# Altium schematic sheet FPGA SDRAM bank.SchDoc: SVPXFMC Carrier 3U
size 420 x 297 mm; CheckedBy: \; Author: G.Kasprowicz; CompanyName: ISE; DrawnBy: T.Przywozki; Organization: WUT ISE; Address1: Warsaw University of Technology; Address2: Nowowiejska 15/19 00-665 Warsaw; Revision: 1.0.; SheetNumber: 5; SheetTotal: 20; Projet: SVPXFMC Carrier 3U; ModifiedBy: -; CheckedDate: -; Title2: FPGA SDRAM BANK; DivGrp: ISE; Designer: G.Kasprowicz; Project: SVPXFMC Carrier 3U
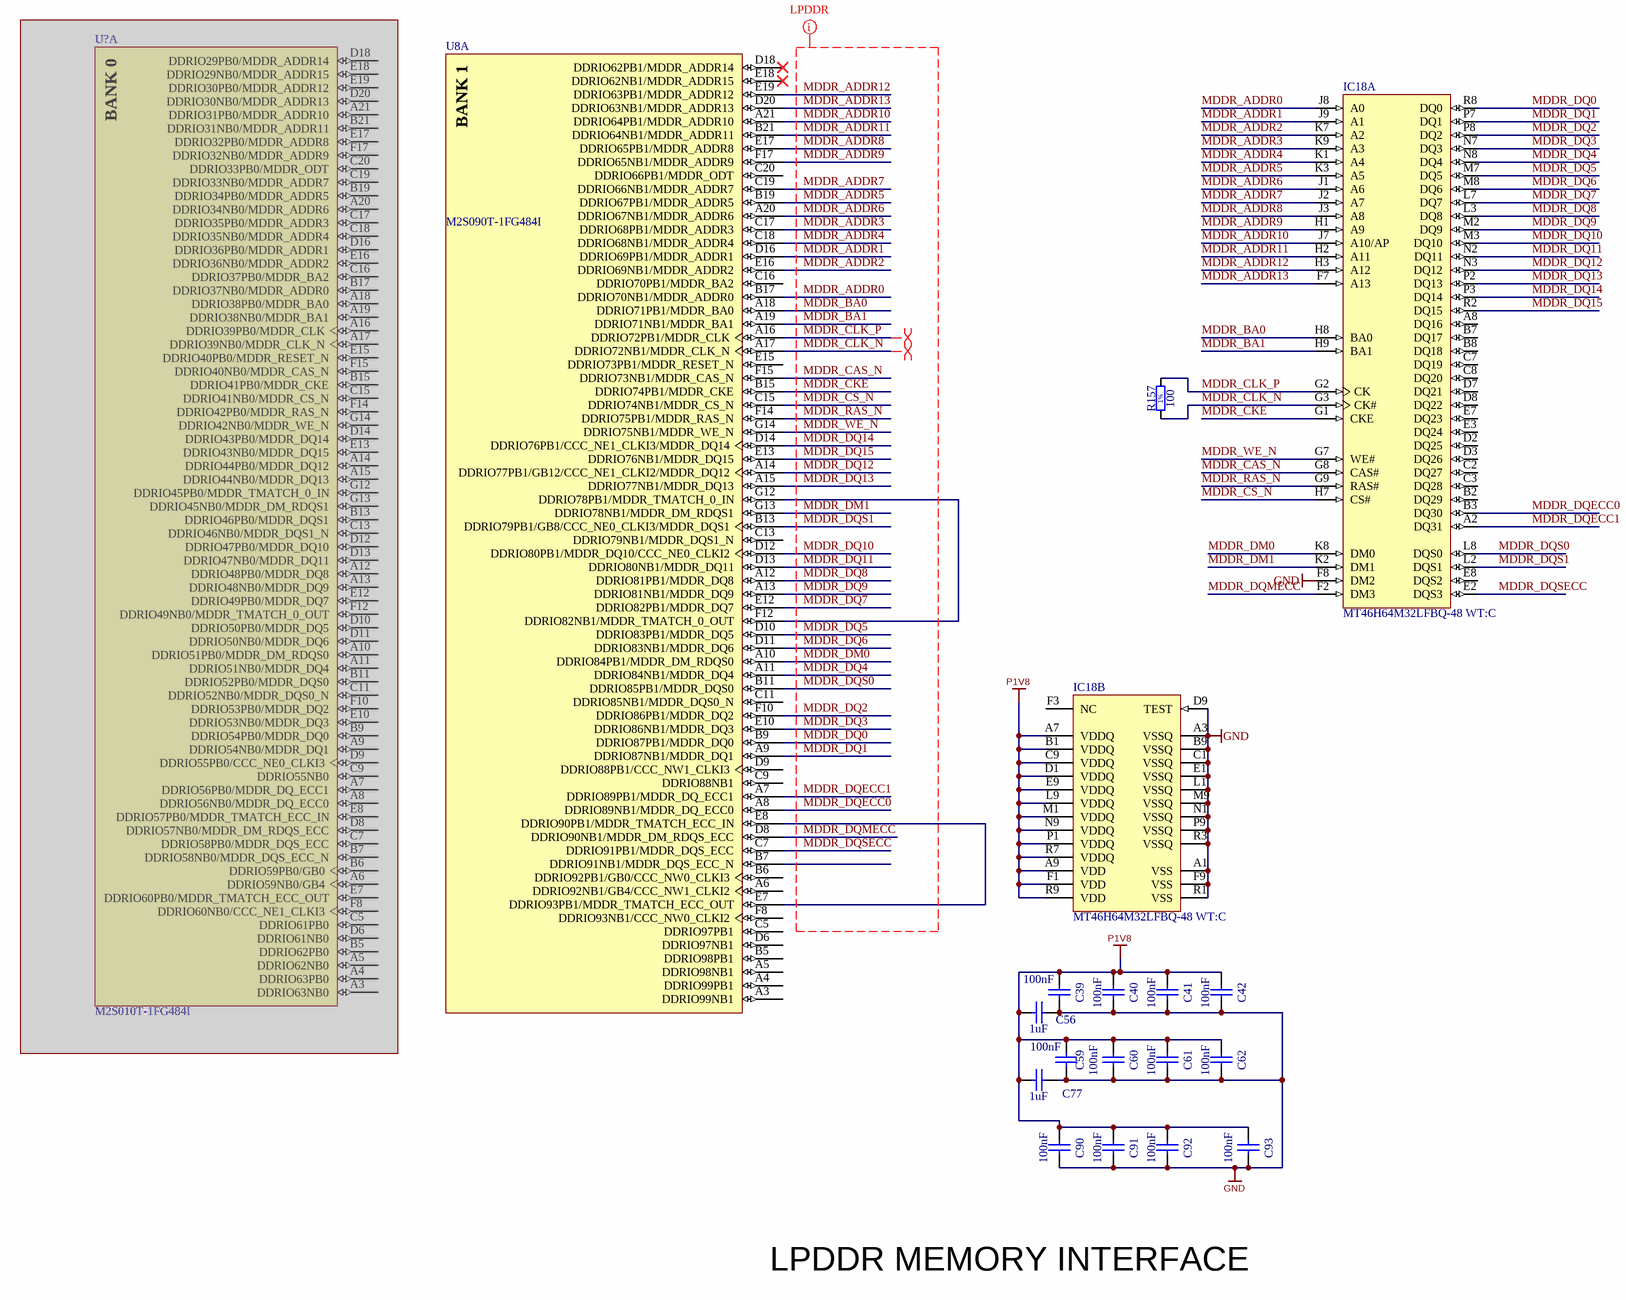
[diagram p0: FPGA SDRAM bank.SchDoc]

## Parts
C39  100nF  [CAPC0603X33N]
C40  100nF  [CAPC0603X33N]
C41  100nF  [CAPC0603X33N]
C42  100nF  [CAPC0603X33N]
C56  1uF  [CAPC1005X55N]
C59  100nF  [CAPC0603X33N]
C60  100nF  [CAPC0603X33N]
C61  100nF  [CAPC0603X33N]
C62  100nF  [CAPC0603X33N]
C77  1uF  [CAPC1005X55N]
C90  100nF  [CAPC0603X33N]
C91  100nF  [CAPC0603X33N]
C92  100nF  [CAPC0603X33N]
C93  100nF  [CAPC0603X33N]
IC18  MT46H64M32LFBQ-48 WT:C  [VFBGA90]  (parts A,B of 2)
R157  100  [RESC0603X28N]
U8  M2S090T-1FG484I  [MCSM-FG-484_V]  (part A of 15)
U?  M2S010T-1FG484I  [MCSM-FG-484_V]  (part A of 16)  (masked out: inside a compile mask, not in the netlist)

## Nets
GND: C39.2 C40.2 C41.2 C42.2 C56.2 C59.2 C60.2 C61.2 C62.2 C77.2 C90.2 C91.2 C92.2 C93.1 IC18.A1(VSS) IC18.A3(VSSQ) IC18.B9(VSSQ) IC18.C1(VSSQ) IC18.D9(TEST) IC18.E1(VSSQ) IC18.F8(DM2) IC18.F9(VSS) IC18.L1(VSSQ) IC18.M9(VSSQ) IC18.N1(VSSQ) IC18.P9(VSSQ) IC18.R1(VSS) IC18.R3(VSSQ)
P1V8: C39.1 C40.1 C41.1 C42.1 C56.1 C59.1 C60.1 C61.1 C62.1 C77.1 C90.1 C91.1 C92.1 C93.2 IC18.A7(VDDQ) IC18.A9(VDD) IC18.B1(VDDQ) IC18.C9(VDDQ) IC18.D1(VDDQ) IC18.E9(VDDQ) IC18.F1(VDD) IC18.L9(VDDQ) IC18.M1(VDDQ) IC18.N9(VDDQ) IC18.P1(VDDQ) IC18.R7(VDDQ) IC18.R9(VDD)
MDDR_ADDR0: IC18.J8(A0) U8.B17(DDRIO70NB1/MDDR_ADDR0)
MDDR_ADDR1: IC18.J9(A1) U8.D16(DDRIO69PB1/MDDR_ADDR1)
MDDR_ADDR2: IC18.K7(A2) U8.E16(DDRIO69NB1/MDDR_ADDR2)
MDDR_ADDR3: IC18.K9(A3) U8.C17(DDRIO68PB1/MDDR_ADDR3)
MDDR_ADDR4: IC18.K1(A4) U8.C18(DDRIO68NB1/MDDR_ADDR4)
MDDR_ADDR5: IC18.K3(A5) U8.B19(DDRIO67PB1/MDDR_ADDR5)
MDDR_ADDR6: IC18.J1(A6) U8.A20(DDRIO67NB1/MDDR_ADDR6)
MDDR_ADDR7: IC18.J2(A7) U8.C19(DDRIO66NB1/MDDR_ADDR7)
MDDR_ADDR8: IC18.J3(A8) U8.E17(DDRIO65PB1/MDDR_ADDR8)
MDDR_ADDR9: IC18.H1(A9) U8.F17(DDRIO65NB1/MDDR_ADDR9)
MDDR_ADDR10: IC18.J7(A10/AP) U8.A21(DDRIO64PB1/MDDR_ADDR10)
MDDR_ADDR11: IC18.H2(A11) U8.B21(DDRIO64NB1/MDDR_ADDR11)
MDDR_ADDR12: IC18.H3(A12) U8.E19(DDRIO63PB1/MDDR_ADDR12)
MDDR_ADDR13: IC18.F7(A13) U8.D20(DDRIO63NB1/MDDR_ADDR13)
MDDR_BA0: IC18.H8(BA0) U8.A18(DDRIO71PB1/MDDR_BA0)
MDDR_BA1: IC18.H9(BA1) U8.A19(DDRIO71NB1/MDDR_BA1)
MDDR_CAS_N: IC18.G8(CAS#) U8.F15(DDRIO73NB1/MDDR_CAS_N)
MDDR_CKE: IC18.G1(CKE) U8.B15(DDRIO74PB1/MDDR_CKE)
MDDR_CLK_N: IC18.G3(CK#) R157.1 U8.A17(DDRIO72NB1/MDDR_CLK_N)
MDDR_CLK_P: IC18.G2(CK) R157.2 U8.A16(DDRIO72PB1/MDDR_CLK)
MDDR_CS_N: IC18.H7(CS#) U8.C15(DDRIO74NB1/MDDR_CS_N)
MDDR_DM0: IC18.K8(DM0) U8.A10(DDRIO84PB1/MDDR_DM_RDQS0)
MDDR_DM1: IC18.K2(DM1) U8.G13(DDRIO78NB1/MDDR_DM_RDQS1)
MDDR_DQ0: IC18.R8(DQ0) U8.B9(DDRIO87PB1/MDDR_DQ0)
MDDR_DQ1: IC18.P7(DQ1) U8.A9(DDRIO87NB1/MDDR_DQ1)
MDDR_DQ2: IC18.P8(DQ2) U8.F10(DDRIO86PB1/MDDR_DQ2)
MDDR_DQ3: IC18.N7(DQ3) U8.E10(DDRIO86NB1/MDDR_DQ3)
MDDR_DQ4: IC18.N8(DQ4) U8.A11(DDRIO84NB1/MDDR_DQ4)
MDDR_DQ5: IC18.M7(DQ5) U8.D10(DDRIO83PB1/MDDR_DQ5)
MDDR_DQ6: IC18.M8(DQ6) U8.D11(DDRIO83NB1/MDDR_DQ6)
MDDR_DQ7: IC18.L7(DQ7) U8.E12(DDRIO82PB1/MDDR_DQ7)
MDDR_DQ8: IC18.L3(DQ8) U8.A12(DDRIO81PB1/MDDR_DQ8)
MDDR_DQ9: IC18.M2(DQ9) U8.A13(DDRIO81NB1/MDDR_DQ9)
MDDR_DQ10: IC18.M3(DQ10) U8.D12(DDRIO80PB1/MDDR_DQ10/CCC_NE0_CLKI2)
MDDR_DQ11: IC18.N2(DQ11) U8.D13(DDRIO80NB1/MDDR_DQ11)
MDDR_DQ12: IC18.N3(DQ12) U8.A14(DDRIO77PB1/GB12/CCC_NE1_CLKI2/MDDR_DQ12)
MDDR_DQ13: IC18.P2(DQ13) U8.A15(DDRIO77NB1/MDDR_DQ13)
MDDR_DQ14: IC18.P3(DQ14) U8.D14(DDRIO76PB1/CCC_NE1_CLKI3/MDDR_DQ14)
MDDR_DQ15: IC18.R2(DQ15) U8.E13(DDRIO76NB1/MDDR_DQ15)
MDDR_DQECC0: IC18.B3(DQ30) U8.A8(DDRIO89NB1/MDDR_DQ_ECC0)
MDDR_DQECC1: IC18.A2(DQ31) U8.A7(DDRIO89PB1/MDDR_DQ_ECC1)
MDDR_DQMECC: IC18.F2(DM3) U8.D8(DDRIO90NB1/MDDR_DM_RDQS_ECC)
MDDR_DQS0: IC18.L8(DQS0) U8.B11(DDRIO85PB1/MDDR_DQS0)
MDDR_DQS1: IC18.L2(DQS1) U8.B13(DDRIO79PB1/GB8/CCC_NE0_CLKI3/MDDR_DQS1)
MDDR_DQSECC: IC18.E2(DQS3) U8.C7(DDRIO91PB1/MDDR_DQS_ECC)
MDDR_RAS_N: IC18.G9(RAS#) U8.F14(DDRIO75PB1/MDDR_RAS_N)
MDDR_WE_N: IC18.G7(WE#) U8.G14(DDRIO75NB1/MDDR_WE_N)
NetU8_E7: U8.E7(DDRIO93PB1/MDDR_TMATCH_ECC_OUT) U8.E8(DDRIO90PB1/MDDR_TMATCH_ECC_IN)
NetU8_F12: U8.F12(DDRIO82NB1/MDDR_TMATCH_0_OUT) U8.G12(DDRIO78PB1/MDDR_TMATCH_0_IN)

Not connected (* = marked no-connect by the designer): IC18 A8(DQ16) B2(DQ29) B7(DQ17) B8(DQ18) C2(DQ27) C3(DQ28) C7(DQ19) C8(DQ20) D2(DQ25) D3(DQ26) D7(DQ21) D8(DQ22) E3(DQ24) E7(DQ23) E8(DQS2) F3(NC); U8 A3(DDRIO99NB1) A4(DDRIO99PB1) A5(DDRIO98NB1) A6(DDRIO92NB1/GB4/CCC_NW1_CLKI2) B5(DDRIO98PB1) B6(DDRIO92PB1/GB0/CCC_NW0_CLKI3) B7(DDRIO91NB1/MDDR_DQS_ECC_N) C5(DDRIO97PB1) C9(DDRIO88NB1) C11(DDRIO85NB1/MDDR_DQS0_N) C13(DDRIO79NB1/MDDR_DQS1_N) C16(DDRIO70PB1/MDDR_BA2) C20(DDRIO66PB1/MDDR_ODT) D6(DDRIO97NB1) D9(DDRIO88PB1/CCC_NW1_CLKI3) D18(DDRIO62PB1/MDDR_ADDR14)* E15(DDRIO73PB1/MDDR_RESET_N) E18(DDRIO62NB1/MDDR_ADDR15)* F8(DDRIO93NB1/CCC_NW0_CLKI2)

## Layout directives
net class LPDDR: MDDR_ADDR0, MDDR_ADDR1, MDDR_ADDR2, MDDR_ADDR3, MDDR_ADDR4, MDDR_ADDR5, MDDR_ADDR6, MDDR_ADDR7, MDDR_ADDR8, MDDR_ADDR9, MDDR_ADDR10, MDDR_ADDR11, MDDR_ADDR12, MDDR_ADDR13, MDDR_BA0, MDDR_BA1, MDDR_CAS_N, MDDR_CKE, MDDR_CLK_N, MDDR_CLK_P, MDDR_CS_N, MDDR_DM0, MDDR_DM1, MDDR_DQ0, MDDR_DQ1, MDDR_DQ2, MDDR_DQ3, MDDR_DQ4, MDDR_DQ5, MDDR_DQ6, MDDR_DQ7, MDDR_DQ8, MDDR_DQ9, MDDR_DQ10, MDDR_DQ11, MDDR_DQ12, MDDR_DQ13, MDDR_DQ14, MDDR_DQ15, MDDR_DQECC0, MDDR_DQECC1, MDDR_DQMECC, MDDR_DQS0, MDDR_DQS1, MDDR_DQSECC, MDDR_RAS_N, MDDR_WE_N
differential pair; differential pair class Diff_100: MDDR_CLK_N, MDDR_CLK_P

## Notes on the sheet
- LPDDR MEMORY INTERFACE
- Project/Equipment
- Document
- Designer
- Drawn by
- Check.by
- File
- Last Mod.
- Print Date
- Sheet
- Size
- A3
- of
- Rev
- Copyright WUT ISE 2019
  This documentation describes Open Hardware and is licensed under the CERN OHL v.1.1. You may redistribute and modify this documentation under the terms of the CERN OHL v1.1.
  (http://ohwr.org/CERNOHL). This documentation is dristributed WITHOUT ANY EXPRESS OR IMPLIED WARRANTY, INCLUDING OF MERCHANTABILITY, SATISFACTORY QUALITY AND FITNESS FOR A PARTICULAR PURPOSE. Please see the CERN OHL v.1.1 for applicable conditions
- (in symbol CMP-0959-00045-1, part A) BANK 1
- (in symbol CMP-0959-00069-1, part A) BANK 0
- (in symbol R0201_100R_1%_0.05W_200PPM) 1%

## Library data of the parts
C39-C42 C59-C62 C90-C93 = CC0201_100NF_6.3V_10%_X5R: Non-polarised capacitor; Manufacturer: GENERIC; Part Description: SMD Multilayer Chip Ceramic Capacitor; Manufacturer1 Part Number: 02016D104KAT2A; Tolerance: ±10%; Voltage: 6.3V; TC: X5R; Manufacturer Part Number: CC0201_100NF_6.3V_10%_X5R; Part Number: CC0201_100NF_6.3V_10%_X5R; Value: 100nF; Component Kind: Standard; Component Type: Standard; Pin Count: 2; Status: Not Recommended; Case: 0201; Mounted: Yes; Socket: No; SMD: Yes; Sense: No; Manufacturer1 Example: AVX; Manufacturer1 ComponentHeight: 0.33mm; HelpURL: \\cern.ch\dfs\Applications\Altium\Datasheets\CC0201_X5R_AVX.pdf; Author: CERN DEM JLC; CreateDate: 03/12/2007; LatestRevisionDate: 03/12/2007
C56 C77 = CC0402_1UF_16V_10%_X5R: Non-polarised capacitor; Manufacturer: GENERIC; Part Description: SMD Multilayer Chip Ceramic Capacitor; Manufacturer1 Part Number: C1005X5R1C105KT; Tolerance: ±10%; Voltage: 16V; TC: X5R; Manufacturer Part Number: CC0402_1UF_16V_10%_X5R; Part Number: CC0402_1UF_16V_10%_X5R; Value: 1uF; Component Kind: Standard; Component Type: Standard; Pin Count: 2; Status: Preferred; Case: 0402; Mounted: Yes; Socket: No; SMD: Yes; Sense: No; Manufacturer1 Example: TDK; Manufacturer1 ComponentHeight: 0.55mm; HelpURL: \\cern.ch\dfs\Applications\Altium\Datasheets\CC0402_X5R_TDK_C.pdf; Author: CERN DEM JLC; CreateDate: 25/10/2012; LatestRevisionDate: 25/10/2012
IC18 = MEM_MT46H64M32LFBQ-48 WT:C: 2Gb LPDDR400 SDRAM, 64Mb x 32, 5ns, 1.8V, -40 to 85 degC, 90-Ball VFBGA, Pb-Free; Manufacturer: Micron; Op. Temp.: -40C to +85C; Clock Rate: 200 MHz; Cycle Time: 5ns; Mounting Technology: Surface Mount; ComponentLink2Description: Datasheet; PackageVersion: Rev.B; ComponentLink2URL: http://www.micron.com/~/media/Documents/Products/Data%20Sheet/DRAM/Mobile%20DRAM/Low-Power%20DRAM/LPDDR/T69M_2Gb_mobile_lpddr_sdram.pdf; DatasheetVersion: Rev.M; Width: x32; Data Rate: LPDDR400; ComponentLink1URL: http://www.micron.com/; ComponentLink3Description: Package Specification; PackageReference: VFBGA90; RoHS: Yes; Voltage: 1.8V; Technology: Mobile LPDDR; ComponentLink1Description: Manufacturer URL; Density: 2Gb; ComponentLink3URL: http://www.micron.com/~/media/Documents/Products/Data%20Sheet/DRAM/Mobile%20DRAM/Low-Power%20DRAM/LPSDR/Y47M_512Mb_mobile_lpsdr_sdram.pdf; PackageDescription: 90-Ball Very Thin Profile Fine-Pitch Ball Grid Array, 13 x 10 mm, Pitch 0.8 mm; PartNumber: MT46H64M32LFBQ-48 WT:C; Pin Count: 90-ball; Package: VFBGA; Part Status: Production; Depth: 64Mb
R157 = R0201_100R_1%_0.05W_200PPM: Resistor - 1%; Part Description: Thick Film Chip Resistor; Manufacturer: GENERIC; Manufacturer1 Part Number: CRCW0201100RFNED; Power: 0.05W; TC: ±200ppm/°C; PressFit: No; Part Number: R0201_100R_1%_0.05W_200PPM; Component Kind: Standard; Component Type: Standard; Pin Count: 2; Value: 100; Status: Not Recommended; Tolerance: ±1%; Manufacturer Part Number: R0201_100R_1%_0.05W_200PPM; Case: 0201; Mounted: Yes; Sense: No; Socket: No; SMD: Yes; Manufacturer1 Example: VISHAY; Manufacturer1 ComponentHeight: 0.27mm; HelpURL: \\cern.ch\dfs\Applications\Altium\Datasheets\R0201_VISHAY_CRCW0201 e3.pdf; Author: CERN DEM JLC; CreateDate: 13.11.2014; LatestRevisionDate: 13.11.2014
U8 = CMP-0959-00045-1: SmartFusion2 SoC FPGA, ARM Cortex-M3, 90 K LUTs, 267 User I/O, Transceiver Available, Design Security, Speed Grade 1, -40 to 100 degC, 484-Ball BGA; Manufacturer: Microsemi; Total User I/O: 267; PLLs and CCCs: 6; LSRAM 18K Blocks: 109; eNVM (K Bytes): 512; DDR Controllers (Count x Width): 1x18; Math Blocks (18x18): 84; Maximum Logic Elements: 86,316; eSRAM (K Bytes): 64; MSIOD (2.5V): 40; SERDES Lanes: 4; MSIO (3.3V): 157; Total RAM (K bits): 2074; DDRIO (2.5V): 70; uSRAM1K Blocks: 112; eSRAM (K Bytes) Non SECDED: 80; ComponentLink3URL: http://www.microsemi.com/document-portal/doc_download/131095-package-mechanical-drawings; DatasheetVersion: Rev. 5; ComponentLink3Description: Package Specification; ComponentLink1Description: Manufacturer URL; PackageReference: FG-484; RoHS: FALSE; ComponentLink1URL: http://www.microsemi.com/; Code_JEDEC: MS-034; Mounting Technology: Surface Mount; PackageDescription: 484-Ball Fine Pitch Plastic Ball Grid Array (FBGA), Body 23 x 23 mm, Pitch 1 mm; PackageVersion: Rev. 48, 11/2013; ComponentLink2URL: http://www.microsemi.com/document-portal/doc_download/130717-smartfusion2-datasheet; PartNumber: M2S090T-1FG484I; ComponentLink2Description: Datasheet; PartId: 1
U? = CMP-0959-00069-1: SmartFusion2 SoC FPGA, ARM Cortex-M3, 10 K LUTs, 233 User I/O, Transceiver Available, Design Security, Speed Grade 1, -40 to 100 degC, 484-Ball BGA; Manufacturer: Microsemi; MSIO (3.3V): 123; DDRIO (2.5V): 70; eSRAM (K Bytes): 64; uSRAM1K Blocks: 22; SERDES Lanes: 4; DDR Controllers (Count x Width): 1x18; MSIOD (2.5V): 40; Maximum Logic Elements: 12,084; eNVM (K Bytes): 256; PLLs and CCCs: 2; LSRAM 18K Blocks: 21; eSRAM (K Bytes) Non SECDED: 80; Total RAM (K bits): 400; Total User I/O: 233; PackageVersion: Rev. 48, 11/2013; ComponentLink3URL: http://www.microsemi.com/document-portal/doc_download/131095-package-mechanical-drawings; ComponentLink1Description: Manufacturer URL; DatasheetVersion: Rev. 5; RoHS: FALSE; ComponentLink2Description: Datasheet; Code_JEDEC: MS-034; ComponentLink3Description: Package Specification; ComponentLink2URL: http://www.microsemi.com/document-portal/doc_download/130717-smartfusion2-datasheet; PartNumber: M2S010T-1FG484I; ComponentLink1URL: http://www.microsemi.com/; Math Blocks (18x18): 22; Mounting Technology: Surface Mount; PackageDescription: 484-Ball Fine Pitch Plastic Ball Grid Array (FBGA), Body 23 x 23 mm, Pitch 1 mm; PackageReference: FG-484